# Altium schematic sheet 18V_Jetson.SchDoc
size A; SheetNumber: 4; SheetTotal: 17
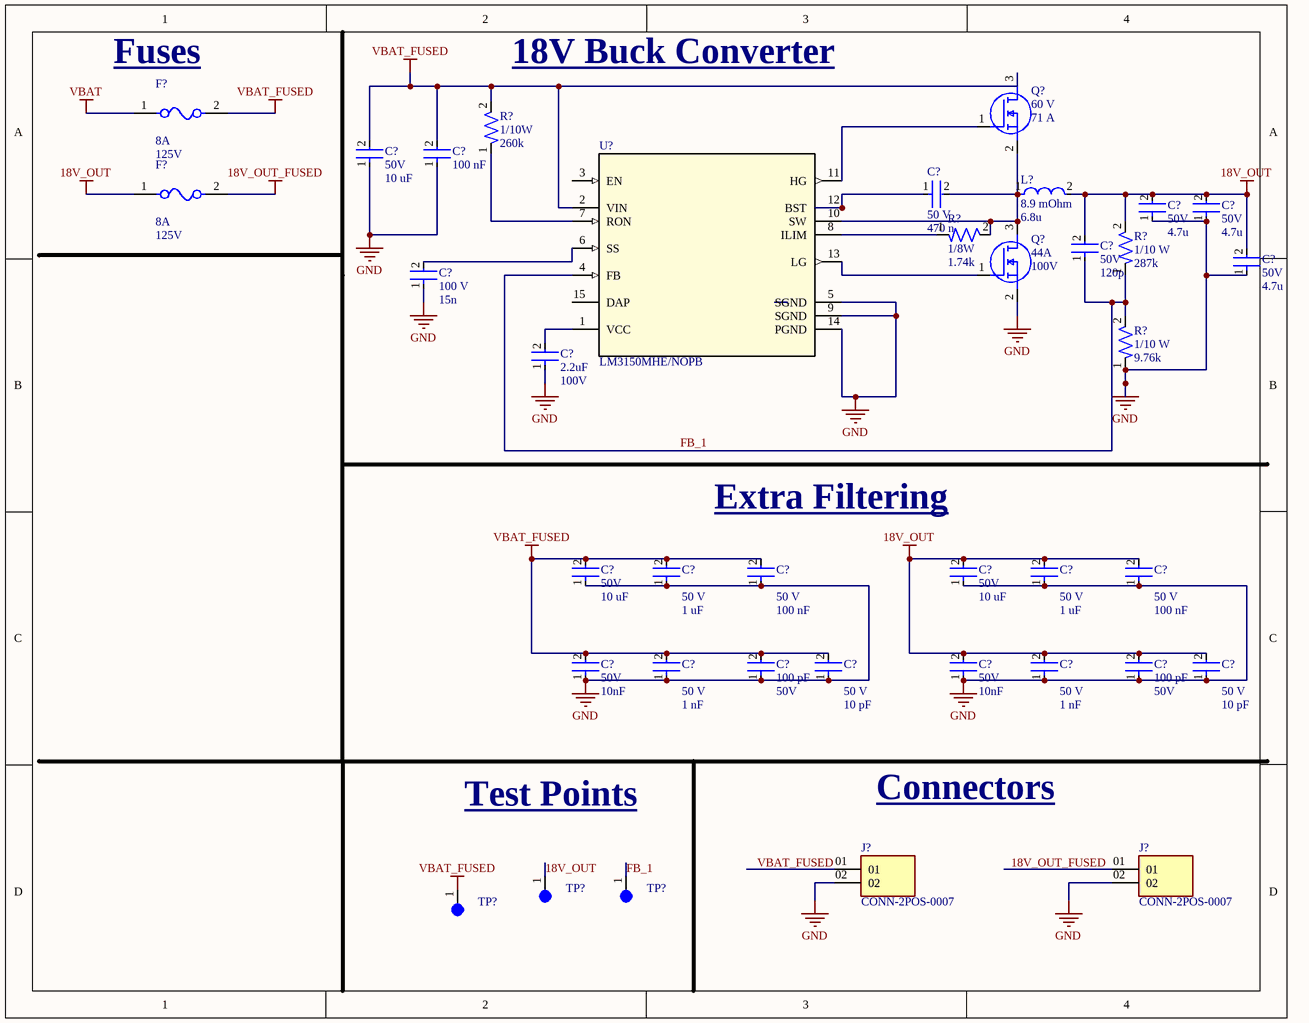
[diagram p0: 18V_Jetson.SchDoc]

## Parts
(Parts that share a designator on the sheet are numbered #1, #2 ... from top to bottom, then left to right.)
C?#1  Capacitance: 100 nF  [CAP-0603]  (hidden comment: GMC10X7S104K100NT)
C?#2  Voltage: 50V  Capacitance: 10 uF  [CAP-1210]  (hidden comment: CL32B106KBJNNNE)
C?#3  Voltage: 50 V  Capacitance: 470 n  [CAP-0805]  (hidden comment: CC0805ZRY5V9BB474)
C?#4  Voltage: 50V  Capacitance: 4.7u  [CAP-1210]  (hidden comment: CC1210KFX7R9BB475)
C?#5  Voltage: 50V  Capacitance: 4.7u  [CAP-1210]  (hidden comment: CC1210KFX7R9BB475)
C?#6  Voltage: 50V  Capacitance: 120p  [CAP-0402]  (hidden comment: CC0402JPNPO9BN121)
C?#7  Voltage: 50V  Capacitance: 4.7u  [CAP-1210]  (hidden comment: CC1210KFX7R9BB475)
C?#8  Voltage: 100 V  Capacitance: 15n  [CAP-0805]  (hidden comment: CC0805KRX7R0BB153)
C?#9  Capacitance: 2.2uF  Voltage: 100V  [CAP-1206]  (hidden comment: CC1206KKX7R0BB225)
C?#10  Voltage: 50 V  Capacitance: 1 uF  [CAP-0805]  (hidden comment: CC0805KKX7R9BB105)
C?#11  Voltage: 50 V  Capacitance: 100 nF  [CAP-0805]  (hidden comment: CC0805KRX7R9BB104)
C?#12  Voltage: 50 V  Capacitance: 1 uF  [CAP-0805]  (hidden comment: CC0805KKX7R9BB105)
C?#13  Voltage: 50 V  Capacitance: 100 nF  [CAP-0805]  (hidden comment: CC0805KRX7R9BB104)
C?#14  Voltage: 50V  Capacitance: 10 uF  [CAP-1210]  (hidden comment: CL32B106KBJNNNE)
C?#15  Voltage: 50V  Capacitance: 10 uF  [CAP-1210]  (hidden comment: CL32B106KBJNNNE)
C?#16  Voltage: 50 V  Capacitance: 1 nF  [CAP-0402]  (hidden comment: CC0402KRX7R9BB102)
C?#17  Voltage: 50 V  Capacitance: 10 pF  [CAP-0402]  (hidden comment: CC0402JRNPO9BN100)
C?#18  Voltage: 50 V  Capacitance: 1 nF  [CAP-0402]  (hidden comment: CC0402KRX7R9BB102)
C?#19  Voltage: 50 V  Capacitance: 10 pF  [CAP-0402]  (hidden comment: CC0402JRNPO9BN100)
C?#20  Voltage: 50V  Capacitance: 10nF  [CAP-0805]  (hidden comment: GRM2195C1H103JA01D)
C?#21  Capacitance: 100 pF  Voltage: 50V  [CAP-0402]  (hidden comment: CC0402JRNPO9BN101)
C?#22  Voltage: 50V  Capacitance: 10nF  [CAP-0805]  (hidden comment: GRM2195C1H103JA01D)
C?#23  Capacitance: 100 pF  Voltage: 50V  [CAP-0402]  (hidden comment: CC0402JRNPO9BN101)
F?#1  Fuse Current: 8A  Voltage Rating: 125V  [FUSE-0001]  (hidden comment: 01550900M)
F?#2  Fuse Current: 8A  Voltage Rating: 125V  [FUSE-0001]  (hidden comment: 01550900M)
J?#1  CONN-2POS-0007  [SAMTEC_HFWJ-02-02-T-S]
J?#2  CONN-2POS-0007  [SAMTEC_HFWJ-02-02-T-S]
L?  Resistance: 8.9 mOhm  Inductance: 6.8u  (hidden comment: XAL1010-682MED)
Q?#1  Max Voltage: 60 V  Max Current: 71 A  [NTMFS5C670NLT1G_ONS]  (hidden comment: NTMFS5C670NLT1G)
Q?#2  Current: 44A  Vdss: 100V  [TRANS_CSD19534Q5A]  (hidden comment: CSD19534Q5A)
R?#1  Power: 1/10W  Resistance: 260k  [RES-0402]  (hidden comment: ERJ-2RKF2743X)
R?#2  Power: 1/8W  Resistance: 1.74k  [RES-0805]  (hidden comment: RC0805FR-071K74L)
R?#3  Power: 1/10 W  Resistance: 287k  (hidden comment: RC0603FR-07287KL)
R?#4  Power: 1/10 W  Resistance: 9.76k  [RES-0603]  (hidden comment: RC0603FR-079K76L)
TP?#1  5003  [TEST-POINT-0001]  (value not drawn)
TP?#2  5003  [TEST-POINT-0001]  (value not drawn)
TP?#3  5003  [TEST-POINT-0001]  (value not drawn)
U?  LM3150MHE/NOPB  [MXA14A]

## Nets
18V_OUT: C?#4.2 C?#5.2 C?#6.2 C?#7.2 C?#12.2 C?#13.2 C?#15.2 C?#18.2 C?#19.2 C?#22.2 C?#23.2 F?#2.1 L?.2 R?#3.2 TP?#1.1
18V_OUT_FUSED: F?#2.2
GND: C?#1.1 C?#2.1 C?#4.1 C?#5.1 C?#7.1 C?#8.1 C?#9.1 C?#10.1 C?#11.1 C?#12.1 C?#13.1 C?#14.1 C?#15.1 C?#16.1 C?#17.1 C?#18.1 C?#19.1 C?#20.1 C?#21.1 C?#22.1 C?#23.1 J?#1.02 J?#2.02 Q?#2.2(S) R?#4.1 U?.5(SGND) U?.9(SGND) U?.14(PGND)
VBAT: F?#1.1
VBAT_FUSED: C?#1.2 C?#2.2 C?#10.2 C?#11.2 C?#14.2 C?#16.2 C?#17.2 C?#20.2 C?#21.2 F?#1.2 Q?#1.3(D) R?#1.2 TP?#3.1 U?.2(VIN)
FB_1: C?#6.1 R?#3.1 R?#4.2 TP?#2.1 U?.4(FB)
NetC?#3_1: C?#3.1 U?.12(BST)
NetC?#3_2: C?#3.2 L?.1 Q?#1.2(S) Q?#2.3(D) R?#2.2 U?.10(SW)
NetC?#8_2: C?#8.2 U?.6(SS)
NetC?#9_2: C?#9.2 U?.1(VCC)
NetQ?#1_1: Q?#1.1(G) U?.11(HG)
NetQ?#2_1: Q?#2.1(G) U?.13(LG)
NetR?#1_1: R?#1.1 U?.7(RON)
NetR?#2_1: R?#2.1 U?.8(ILIM)

Not connected (* = marked no-connect by the designer): J?#1 01; J?#2 01; U? 3(EN) 15(DAP)

## Notes on the sheet
- (near F?#1) Fuses
- (near R?#1) 18V Buck Converter
- (near C?#11) Extra Filtering
- Test Points
- Connectors
- Labels drawn without touching a wire or pin: 18V_OUT_FUSED, VBAT_FUSED

## Library data of the parts
C?#1 = CAP-100N-0001: 0.1 µF ±10% 100V Ceramic Capacitor X7S 0603 (1608 Metric)
C?#2 C?#14 C?#15 = CAP-10U-0002: CAP CER 10UF 50V X7R 1210; Device Class: Ceramic; Size: 1210; ComponentLink1Description: Datasheet; ComponentLink1URL: https://mm.digikey.com/Volume0/opasdata/d220001/medias/docus/41/CL32B106KBJNNNE_Spec.pdf
C?#3 = CAP-470N-0002: 0.47 µF -20%, +80% 50V Ceramic Capacitor Y5V (F) 0805 (2012 Metric)
C?#4 C?#5 C?#7 = CAP-4.7U-0003: 4.7 µF ±10% 50V Ceramic Capacitor X7R 1210 (3225 Metric)
C?#6 = CAP-120p-0001: CAP CER 120PF 50V C0G/NPO 0402
C?#8 = CAP-15N-0001: 0.015 µF ±10% 100V Ceramic Capacitor X7R 0805 (2012 Metric)
C?#9 = CAP-2.2U-0001: CAP CER 2.2UF 100V X7R 1206; Device Class: Ceramic; Size: 1206; ComponentLink1Description: Datasheet; ComponentLink1URL: https://www.yageo.com/upload/media/product/productsearch/datasheet/mlcc/UPY-GPHC_X7R_6.3V-to-250V_24.pdf
C?#10 C?#12 = CAP-1U-0001: 1 µF ±10% 50V Ceramic Capacitor X7R 0805 (2012 Metric)
C?#11 C?#13 = CAP-100N-0002: 0.1 µF ±10% 50V Ceramic Capacitor X7R 0805 (2012 Metric)
C?#16 C?#18 = CAP-1N-0001: 1000 pF ±10% 50V Ceramic Capacitor X7R 0402 (1005 Metric)
C?#17 C?#19 = CAP-10P-0001: 10 pF ±5% 50V Ceramic Capacitor C0G, NP0 0402 (1005 Metric)
C?#20 C?#22 = CAP-10N-0001: CAP CER 10000PF 50V C0G/NP0 0805; Device Class: Ceramic; Size: 0805; ComponentLink1Description: Datasheet; ComponentLink1URL: https://search.murata.co.jp/Ceramy/image/img/A01X/G101/ENG/GRM2195C1H103JA01-01.pdf
C?#21 C?#23 = CAP-100P-0001: CAP CER 100PF 50V C0G/NPO 0402; Device Class: Ceramic; Size: 0402; ComponentLink1Description: Datasheet; ComponentLink1URL: https://www.yageo.com/upload/media/product/productsearch/datasheet/mlcc/UPY-GP_NP0_16V-to-50V_18.pdf
F?#1 F?#2 = FUSE-0001: FUSE BLOK CARTRIDGE 125V 10A SMD; ComponentLink2Description: Datasheet; ComponentLink2URL: https://www.littelfuse.com/~/media/electronics/datasheets/fuses/littelfuse_fuse_154_154t_154l_154tl_datasheet.pdf.pdf
J?#1 J?#2 = CONN-2POS-0007: Conn Unshrouded Header HDR 2 POS 3.96mm Solder ST Thru-Hole Bulk; MF: Samtec; MP: HFWJ-02-02-T-S; SnapEDA_Link: https://www.snapeda.com/parts/HFWJ-02-02-T-S/Samtec/view-part/?ref=snap; Package: None; Value: *; Check_prices: https://www.snapeda.com/parts/HFWJ-02-02-T-S/Samtec/view-part/?ref=eda
L? = IND-6.8u-0001: 6.8 µH Shielded Molded Inductor 14 A 8.9mOhm Max Nonstandard
Q?#1 = NMOS-71A-0001: N-Channel 60 V 17A (Ta), 71A (Tc) 3.6W (Ta), 61W (Tc) Surface Mount 5-DFN (5x6) (8-SOFL); Manufacturer_Name: onsemi; Copyright: Copyright (C) 2025 Ultra Librarian. All rights reserved.; Manufacturer_Part_Number: NTMFS5C670NLT1G; RefDes: RefDes; Type: Type
Q?#2 = MOS-44A-0001: 100V, N ch NexFET MOSFET, single SON5x6, 15.1mOhm 8-VSONP -55 to 150; MF: Texas Instruments; Vth: 3.4V; Mouser-Purchase-URL: https://snapeda.com/shop?store=Mouser&id=485742; Package: VSONP-8 Texas Instruments; Texas_Instruments-Purchase-URL: https://snapeda.com/shop?store=Texas+Instruments&id=485742; Value: *; Price: None; DigiKey-Purchase-URL: https://snapeda.com/shop?store=DigiKey&id=485742; MP: CSD19534Q5A; SnapEDA_Link: https://www.snapeda.com/parts/CSD19534Q5A/Texas%20Instruments/view-part/485742/?ref=snap; Availability: Good
R?#1 = RES-260k-0001: RES SMD 274K OHM 1% 1/10W 0402
R?#2 = RES-1.74k-0001: RES 1.74K OHM 1% 1/8W 0805
R?#3 = RES-287k-0001: RES 287K OHM 1% 1/10W 0603
R?#4 = RES-9.76k-0001: RES 9.76K OHM 1% 1/10W 0603
TP?#1-TP?#3 = TEST-POINT-0001: Oranange PC Test Point, Miniature Phoisphor Bronze Silver Plating Through Hole Mounting Type
U? = IC-BUCK_0011: 6V to 42V Synchronous Step-Down Controller with Adjustable Output Voltage 14-HTSSOP -40 to 125; Manufacturer_Name: Texas Instruments; Copyright: Copyright (C) 2025 Ultra Librarian. All rights reserved.; Manufacturer_Part_Number: LM3150MHE/NOPB; Datasheet: https://www.ti.com/lit/gpn/lm3150; RefDes: RefDes; Type: Type